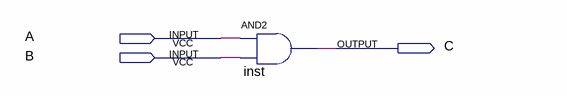
[diagram p0: schematic sheet]
// Quartus schematic and_gate.bdf as structural Verilog: 1 symbols, 3 pins
module and_gate (
  input  A,
  input  B,
  output C
);

  and inst (C, A, B);
endmodule
